# Altium schematic sheet Procesor.SchDoc
size A3
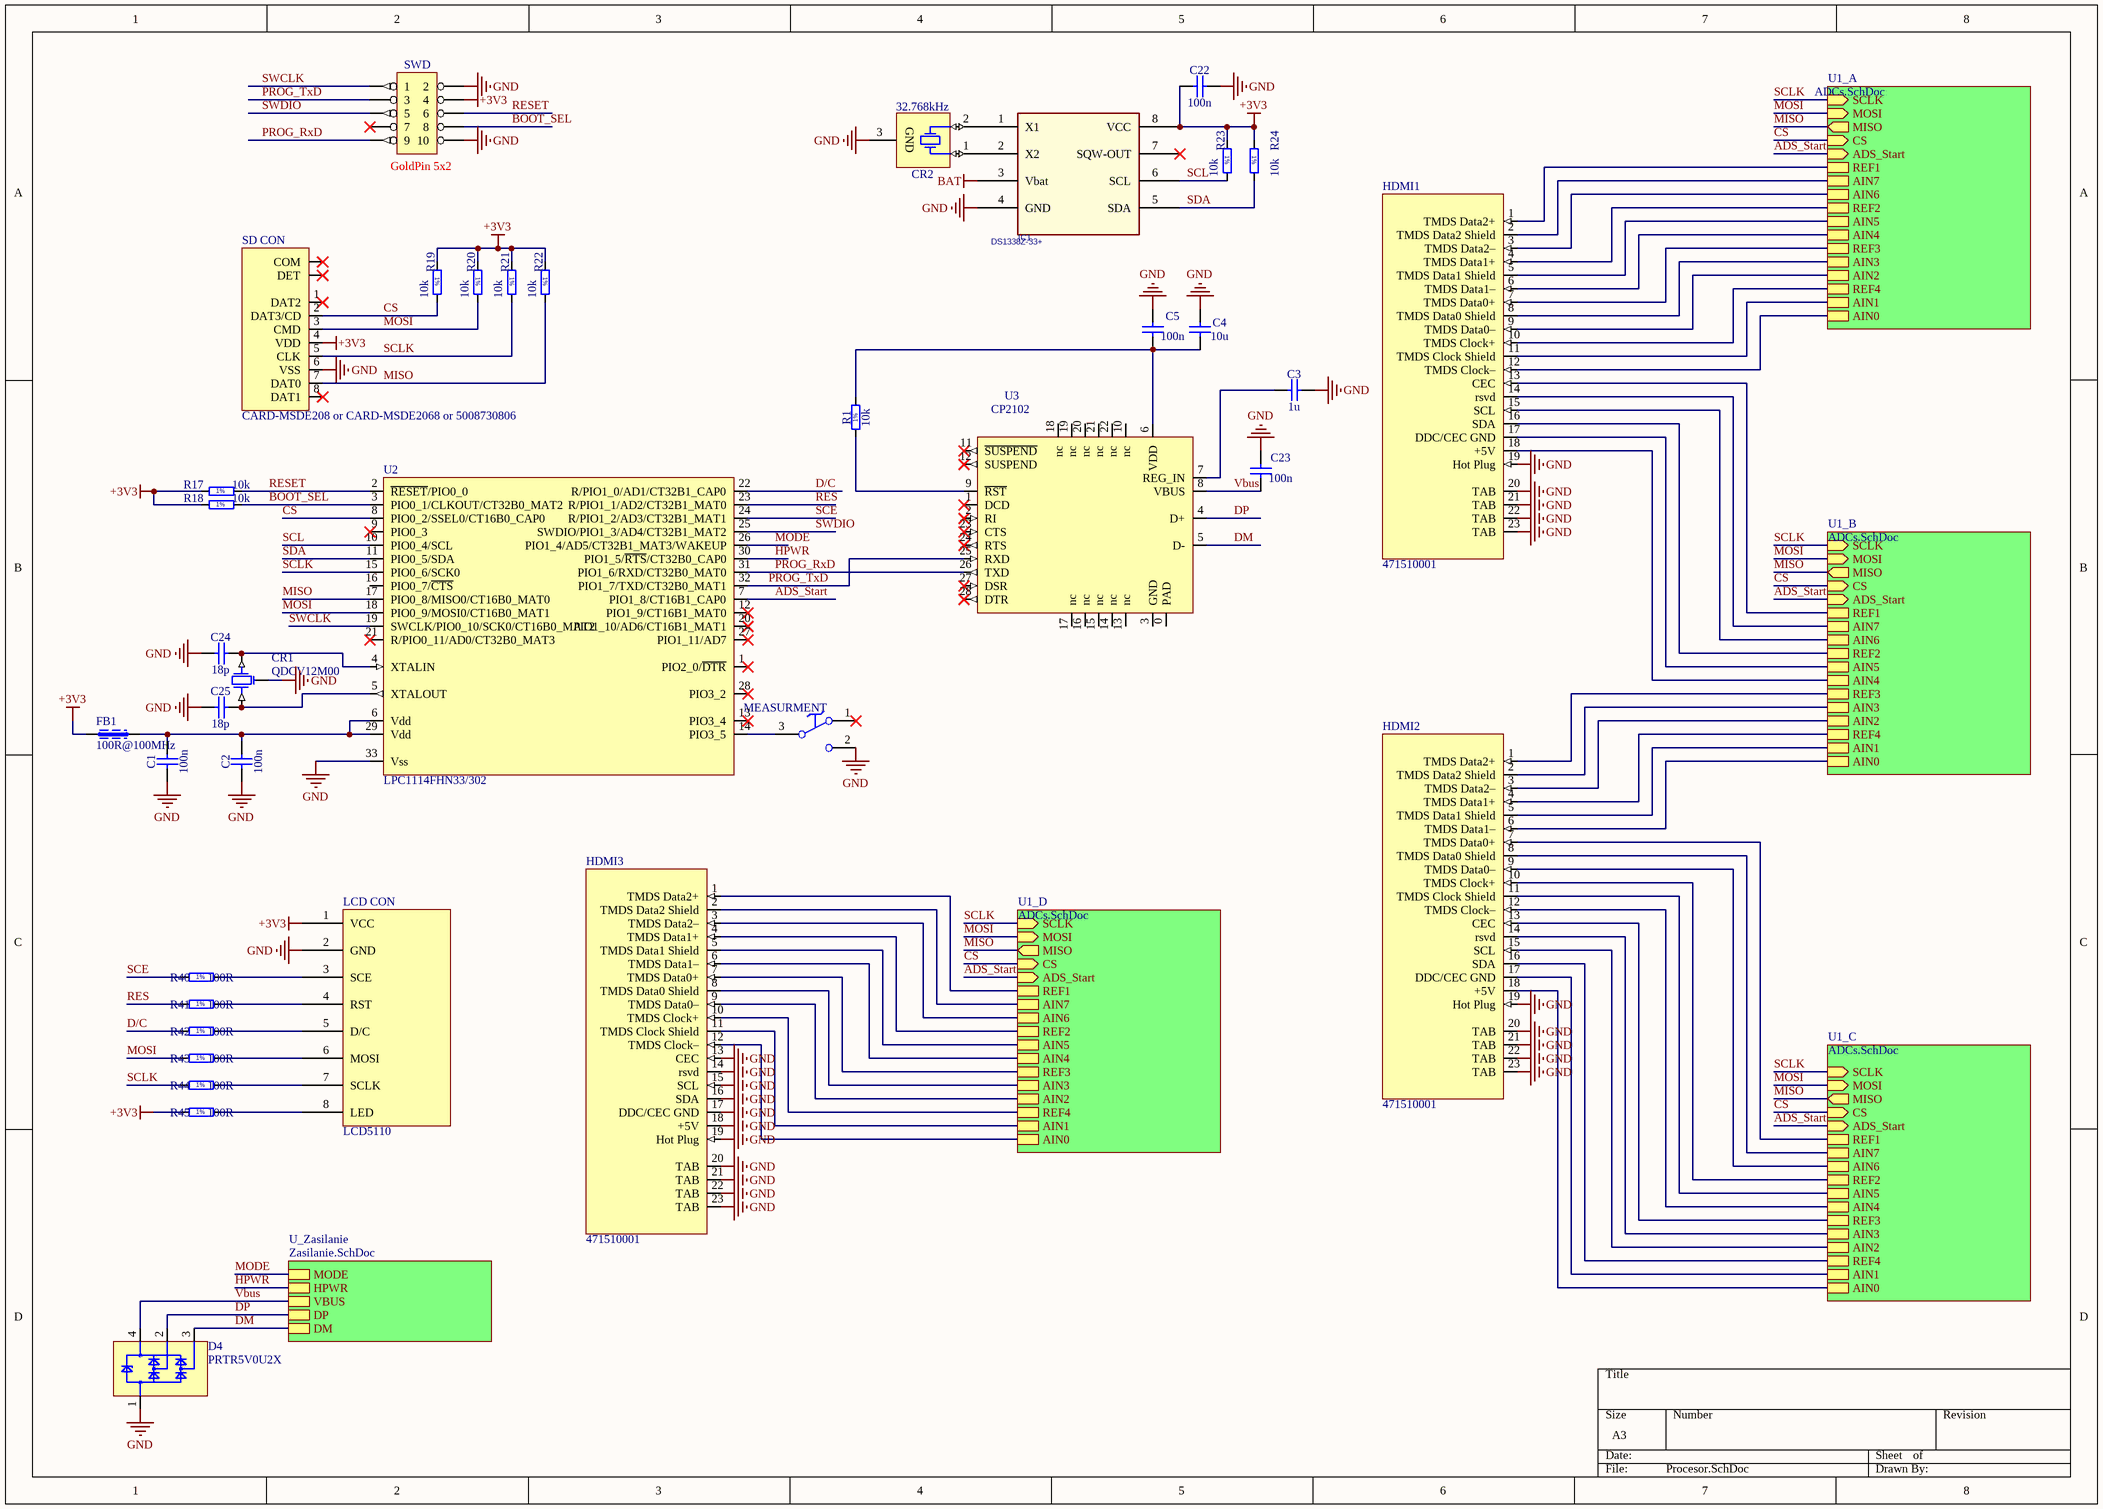
[diagram p0: Procesor.SchDoc]

## Parts
C1  100n  [CAPC1005X55N]
C2  100n  [CAPC1005X55N]
C3  1u  [CAPC1608X87N]
C4  10u  [CAPC2012X135N]
C5  100n  [CAPC1005X55N]
C22  100n  [CAPC1005X55N]
C23  100n  [CAPC1005X55N]
C24  18p  [CAPC1608X87N]
C25  18p  [CAPC1608X87N]
CR1  QDCV12M00  [CERAMIC_RES_QDCV]
CR2  32.768kHz  [XTAL_MICRO-CRYSTAL_MS3V-T1R]
D4  PRTR5V0U2X  [sot143b]
FB1  100R@100MHz  [0603L]
HDMI1  471510001  [HDMI_471510001]
HDMI2  471510001  [HDMI_471510001]
HDMI3  471510001  [HDMI_471510001]
IC1  DS1338Z-33+  [SO-8]
LCD_CON  LCD5110  [Goldpin1x8SMD]
MEASURMENT  Switch  [SW_MENTOR_1850]  (value not drawn)
R1  10k  [RESC1005X40N]
R17  10k  [RESC1608X55N]
R18  10k  [RESC1608X55N]
R19  10k  [RESC1005X40N]
R20  10k  [RESC1005X40N]
R21  10k  [RESC1005X40N]
R22  10k  [RESC1005X40N]
R23  10k  [RESC1005X40N]
R24  10k  [RESC1005X40N]
R40  100R  [RESC1005X40N]
R41  100R  [RESC1005X40N]
R42  100R  [RESC1005X40N]
R43  100R  [RESC1005X40N]
R44  100R  [RESC1005X40N]
R45  100R  [RESC1005X40N]
SD_CON  CARD-MSDE208 or CARD-MSDE2068 or 5008730806  [MSDE208]
SWD  GoldPin 5x2  [CON_2x5_MINI]
U2  LPC1114FHN33/302  [HVQFN33_QFN127P600-8N]
U3  CP2102  [QFN28]

## Sub-sheets
U1_A = ADCs.SchDoc: SCLK (in), MOSI (in), MISO (out), CS (in), ADS_Start (in), REF1, AIN7, AIN6, REF2, AIN5, AIN4, REF3, AIN3, REF4, AIN2, AIN1, AIN0
U1_B = ADCs.SchDoc: SCLK (in), MOSI (in), MISO (out), CS (in), ADS_Start (in), REF1, AIN7, AIN6, REF2, AIN5, AIN4, REF3, AIN3, REF4, AIN2, AIN1, AIN0
U1_C = ADCs.SchDoc: SCLK (in), MOSI (in), MISO (out), CS (in), ADS_Start (in), REF1, AIN7, AIN6, REF2, AIN5, AIN4, REF3, AIN3, REF4, AIN2, AIN1, AIN0
U1_D = ADCs.SchDoc: SCLK (in), MOSI (in), MISO (out), CS (in), ADS_Start (in), REF1, AIN7, AIN6, REF2, AIN5, AIN4, REF3, AIN3, REF4, AIN2, AIN1, AIN0
U_Zasilanie = Zasilanie.SchDoc: DM, DP, VBUS, HPWR, MODE

## Nets
+3V3: C22.1 FB1.1 IC1.8(VCC) LCD_CON.1(VCC) R17.1 R18.1 R19.1 R20.1 R21.1 R22.1 R23.1 R24.1 R45.1 SD_CON.4(VDD) SWD.4
BAT: IC1.3(Vbat)
GND: C1.1 C2.1 C3.2 C4.1 C5.2 C22.2 C23.2 C24.1 C25.1 CR1.2 CR2.3(GND) D4.1 HDMI1.19(Hot_Plug) HDMI1.20(TAB) HDMI1.21(TAB) HDMI1.22(TAB) HDMI1.23(TAB) HDMI2.19(Hot_Plug) HDMI2.20(TAB) HDMI2.21(TAB) HDMI2.22(TAB) HDMI2.23(TAB) HDMI3.13(CEC) HDMI3.14(rsvd) HDMI3.15(SCL) HDMI3.16(SDA) HDMI3.17(DDC/CEC_GND) HDMI3.18(+5V) HDMI3.19(Hot_Plug) HDMI3.20(TAB) HDMI3.21(TAB) HDMI3.22(TAB) HDMI3.23(TAB) IC1.4(GND) LCD_CON.2(GND) MEASURMENT.2 SD_CON.6(VSS) SWD.2 SWD.10 U2.33(Vss)
ADS_Start: U2.7(PIO1_8/CT16B1_CAP0) ; sheet U1_A/ADS_Start, sheet U1_B/ADS_Start, sheet U1_C/ADS_Start, sheet U1_D/ADS_Start
BOOT_SEL: R18.2 SWD.8 U2.3(PIO0_1/CLKOUT/CT32B0_MAT2)
CS: R19.2 SD_CON.2(DAT3/CD) U2.8(PIO0_2/SSEL0/CT16B0_CAP0) ; sheet U1_A/CS, sheet U1_B/CS, sheet U1_C/CS, sheet U1_D/CS
D/C: R42.1 U2.22(R/PIO1_0/AD1/CT32B1_CAP0)
DM: D4.3 U3.5(D-) ; sheet U_Zasilanie/DM
DP: D4.2 U3.4(D+) ; sheet U_Zasilanie/DP
HPWR: U2.30(PIO1_5/~{RTS}/CT32B0_CAP0) ; sheet U_Zasilanie/HPWR
MISO: R22.2 SD_CON.7(DAT0) U2.17(PIO0_8/MISO0/CT16B0_MAT0) ; sheet U1_A/MISO, sheet U1_B/MISO, sheet U1_C/MISO, sheet U1_D/MISO
MODE: U2.26(PIO1_4/AD5/CT32B1_MAT3/WAKEUP) ; sheet U_Zasilanie/MODE
MOSI: R20.2 R43.1 SD_CON.3(CMD) U2.18(PIO0_9/MOSI0/CT16B0_MAT1) ; sheet U1_A/MOSI, sheet U1_B/MOSI, sheet U1_C/MOSI, sheet U1_D/MOSI
PROG_RxD: SWD.9 U2.31(PIO1_6/RXD/CT32B0_MAT0) U3.26(TXD)
PROG_TxD: SWD.3 U2.32(PIO1_7/TXD/CT32B0_MAT1) U3.25(RXD)
RES: R41.1 U2.23(R/PIO1_1/AD2/CT32B1_MAT0)
RESET: R17.2 SWD.6 U2.2(~{RESET}/PIO0_0)
SCE: R40.1 U2.24(R/PIO1_2/AD3/CT32B1_MAT1)
SCL: IC1.6(SCL) R23.2 U2.10(PIO0_4/SCL)
SCLK: R21.2 R44.1 SD_CON.5(CLK) U2.15(PIO0_6/SCK0) ; sheet U1_A/SCLK, sheet U1_B/SCLK, sheet U1_C/SCLK, sheet U1_D/SCLK
SDA: IC1.5(SDA) R24.2 U2.11(PIO0_5/SDA)
SWCLK: SWD.1 U2.19(SWCLK/PIO0_10/SCK0/CT16B0_MAT2)
SWDIO: SWD.5 U2.25(SWDIO/PIO1_3/AD4/CT32B1_MAT2)
Vbus: C23.1 D4.4 U3.8(VBUS) ; sheet U_Zasilanie/VBUS
NetC1_2: C1.2 C2.2 FB1.2 U2.6(Vdd) U2.29(Vdd)
NetC3_1: C3.1 U3.7(REG_IN)
NetC4_2: C4.2 C5.1 R1.2 U3.6(VDD)
NetC24_2: C24.2 CR1.1 U2.4(XTALIN)
NetC25_2: C25.2 CR1.3 U2.5(XTALOUT)
NetCR2_1: CR2.1(X) IC1.2(X2)
NetCR2_2: CR2.2(X) IC1.1(X1)
NetHDMI1_1: HDMI1.1(TMDS_Data2+) ; sheet U1_A/REF1
NetHDMI1_2: HDMI1.2(TMDS_Data2_Shield) ; sheet U1_A/AIN7
NetHDMI1_3: HDMI1.3(TMDS_Data2–) ; sheet U1_A/AIN6
NetHDMI1_4: HDMI1.4(TMDS_Data1+) ; sheet U1_A/REF2
NetHDMI1_5: HDMI1.5(TMDS_Data1_Shield) ; sheet U1_A/AIN5
NetHDMI1_6: HDMI1.6(TMDS_Data1–) ; sheet U1_A/AIN4
NetHDMI1_7: HDMI1.7(TMDS_Data0+) ; sheet U1_A/REF3
NetHDMI1_8: HDMI1.8(TMDS_Data0_Shield) ; sheet U1_A/AIN3
NetHDMI1_9: HDMI1.9(TMDS_Data0–) ; sheet U1_A/AIN2
NetHDMI1_10: HDMI1.10(TMDS_Clock+) ; sheet U1_A/REF4
NetHDMI1_11: HDMI1.11(TMDS_Clock_Shield) ; sheet U1_A/AIN1
NetHDMI1_12: HDMI1.12(TMDS_Clock–) ; sheet U1_A/AIN0
NetHDMI1_13: HDMI1.13(CEC) ; sheet U1_B/REF1
NetHDMI1_14: HDMI1.14(rsvd) ; sheet U1_B/AIN7
NetHDMI1_15: HDMI1.15(SCL) ; sheet U1_B/AIN6
NetHDMI1_16: HDMI1.16(SDA) ; sheet U1_B/REF2
NetHDMI1_17: HDMI1.17(DDC/CEC_GND) ; sheet U1_B/AIN5
NetHDMI1_18: HDMI1.18(+5V) ; sheet U1_B/AIN4
NetHDMI2_1: HDMI2.1(TMDS_Data2+) ; sheet U1_B/REF3
NetHDMI2_2: HDMI2.2(TMDS_Data2_Shield) ; sheet U1_B/AIN3
NetHDMI2_3: HDMI2.3(TMDS_Data2–) ; sheet U1_B/AIN2
NetHDMI2_4: HDMI2.4(TMDS_Data1+) ; sheet U1_B/REF4
NetHDMI2_5: HDMI2.5(TMDS_Data1_Shield) ; sheet U1_B/AIN1
NetHDMI2_6: HDMI2.6(TMDS_Data1–) ; sheet U1_B/AIN0
NetHDMI2_7: HDMI2.7(TMDS_Data0+) ; sheet U1_C/REF1
NetHDMI2_8: HDMI2.8(TMDS_Data0_Shield) ; sheet U1_C/AIN7
NetHDMI2_9: HDMI2.9(TMDS_Data0–) ; sheet U1_C/AIN6
NetHDMI2_10: HDMI2.10(TMDS_Clock+) ; sheet U1_C/REF2
NetHDMI2_11: HDMI2.11(TMDS_Clock_Shield) ; sheet U1_C/AIN5
NetHDMI2_12: HDMI2.12(TMDS_Clock–) ; sheet U1_C/AIN4
NetHDMI2_13: HDMI2.13(CEC) ; sheet U1_C/REF3
NetHDMI2_14: HDMI2.14(rsvd) ; sheet U1_C/AIN3
NetHDMI2_15: HDMI2.15(SCL) ; sheet U1_C/AIN2
NetHDMI2_16: HDMI2.16(SDA) ; sheet U1_C/REF4
NetHDMI2_17: HDMI2.17(DDC/CEC_GND) ; sheet U1_C/AIN1
NetHDMI2_18: HDMI2.18(+5V) ; sheet U1_C/AIN0
NetHDMI3_1: HDMI3.1(TMDS_Data2+) ; sheet U1_D/REF1
NetHDMI3_2: HDMI3.2(TMDS_Data2_Shield) ; sheet U1_D/AIN7
NetHDMI3_3: HDMI3.3(TMDS_Data2–) ; sheet U1_D/AIN6
NetHDMI3_4: HDMI3.4(TMDS_Data1+) ; sheet U1_D/REF2
NetHDMI3_5: HDMI3.5(TMDS_Data1_Shield) ; sheet U1_D/AIN5
NetHDMI3_6: HDMI3.6(TMDS_Data1–) ; sheet U1_D/AIN4
NetHDMI3_7: HDMI3.7(TMDS_Data0+) ; sheet U1_D/REF3
NetHDMI3_8: HDMI3.8(TMDS_Data0_Shield) ; sheet U1_D/AIN3
NetHDMI3_9: HDMI3.9(TMDS_Data0–) ; sheet U1_D/AIN2
NetHDMI3_10: HDMI3.10(TMDS_Clock+) ; sheet U1_D/REF4
NetHDMI3_11: HDMI3.11(TMDS_Clock_Shield) ; sheet U1_D/AIN1
NetHDMI3_12: HDMI3.12(TMDS_Clock–) ; sheet U1_D/AIN0
NetLCD_CON_3: LCD_CON.3(SCE) R40.2
NetLCD_CON_4: LCD_CON.4(RST) R41.2
NetLCD_CON_5: LCD_CON.5(D/C) R42.2
NetLCD_CON_6: LCD_CON.6(MOSI) R43.2
NetLCD_CON_7: LCD_CON.7(SCLK) R44.2
NetLCD_CON_8: LCD_CON.8(LED) R45.2
NetMEASURMENT_3: MEASURMENT.3 U2.14(PIO3_5)
NetR1_1: R1.1 U3.9(~{RST})

Not connected (* = marked no-connect by the designer): IC1 7(SQW-OUT)*; MEASURMENT 1*; SD_CON 1(DAT2)* 8(DAT1)* CD(DET)* COM*; SWD 7*; U2 1(PIO2_0/~{DTR})* 9(PIO0_3)* 12(PIO1_9/CT16B1_MAT0)* 13(PIO3_4)* 16(PIO0_7/~{CTS}) 20(PIO1_10/AD6/CT16B1_MAT1)* 21(R/PIO0_11/AD0/CT32B0_MAT3)* 27(PIO1_11/AD7)* 28(PIO3_2)*; U3 0(PAD) 1(DCD)* 2(RI)* 3(GND) 10(nc) 11(~{SUSPEND})* 12(SUSPEND)* 13(nc) 14(nc) 15(nc) 16(nc) 17(nc) 18(nc) 19(nc) 20(nc) 21(nc) 22(nc) 23(CTS)* 24(RTS)* 27(DSR)* 28(DTR)*

## Notes on the sheet
- (in symbol R0402_10K_1%_0.0625W_100PPM) 1%
- (in symbol R0402_10R_1%_0.0625W_200PPM) 1%
- (in symbol R0603_10K_1%_0.1W_100PPM) 1%

## Library data of the parts
C1 C2 C5 C22 C23 = CC0402_100NF_16V_10%_X7R: Non-polarised capacitor; Part Description: SMD Multilayer Chip Ceramic Capacitor; Manufacturer: GENERIC; Manufacturer1 Part Number: 223878715649; Value: 100nF; Voltage: 16V; TC: X7R; Tolerance: ±10%; Table: Capacitors SMD; Part Number: CC0402_100NF_16V_10%_X7R; Component Kind: Standard; Component Type: Standard; Pin Count: 2; Status: Not Recommended; Manufacturer Part Number: CC0402_100NF_16V_10%_X7R; Case: 0402; Mounted: Yes; Socket: No; SMD: Yes; Manufacturer1 Example: PHYCOMP; Manufacturer1 ComponentHeight: 0.55mm; HelpURL: \\cern.ch\dfs\Applications\Altium\Datasheets\CC0402_X7R_PHYCOMP.pdf; Author: CERN DEM JLC; CreateDate: 2007-12-03; LatestRevisionDate: 2007-12-03
C3 = CC0603_1UF_16V_10%_X7R: Non-polarised capacitor; Part Description: SMD Multilayer Chip Ceramic Capacitor; Manufacturer: GENERIC; Manufacturer1 Part Number: 223824613663; Value: 1uF; Voltage: 16V; TC: X7R; Tolerance: ±10%; Table: Capacitors SMD; Part Number: CC0603_1UF_16V_10%_X7R; Component Kind: Standard; Component Type: Standard; Pin Count: 2; Status: Preferred; Manufacturer Part Number: CC0603_1uF_16V_10%_X7R; Case: 0603; Mounted: Yes; Socket: No; SMD: Yes; Manufacturer1 Example: PHYCOMP; Manufacturer1 ComponentHeight: 0.87mm; HelpURL: \\cern.ch\dfs\Applications\Altium\Datasheets\CC0805_X5R_PHYCOMP_HC.pdf; Author: CERN DEM JLC; CreateDate: 2007-12-03; LatestRevisionDate: 2007-12-03
C4 = CC0805_10UF_16V_10%_X5R: Non-polarised capacitor; Part Description: SMD Multilayer Chip Ceramic Capacitor; Manufacturer: GENERIC; Manufacturer1 Part Number: C0805C106K4PAC; Value: 10uF; Voltage: 16V; TC: X5R; Tolerance: ±10%; Table: Capacitors SMD; Part Number: CC0805_10UF_16V_10%_X5R; Component Kind: Standard; Component Type: Standard; Pin Count: 2; Status: Preferred; Manufacturer Part Number: CC0805_10UF_16V_10%_X5R; Case: 0805; Mounted: Yes; Socket: No; SMD: Yes; Manufacturer1 Example: KEMET; Manufacturer1 ComponentHeight: 1.4mm; HelpURL: \\cern.ch\dfs\Applications\Altium\Datasheets\CC1206_X5R_KEMET.pdf; Author: CERN DEM JLC; CreateDate: 2007-12-03; LatestRevisionDate: 2007-12-03
C24 C25 = CC0603_18PF_50V_5%_NP0: Non-polarised capacitor; Part Description: SMD Multilayer Chip Ceramic Capacitor; Manufacturer: GENERIC; Manufacturer1 Part Number: 223886715189; Value: 18pF; Voltage: 50V; TC: NP0; Tolerance: ±5%; Table: Capacitors SMD; Part Number: CC0603_18PF_50V_5%_NP0; Component Kind: Standard; Component Type: Standard; Pin Count: 2; Status: Preferred; Manufacturer Part Number: CC0603_18PF_50V_5%_NP0; Case: 0603; Mounted: Yes; Socket: No; SMD: Yes; Manufacturer1 Example: PHYCOMP; Manufacturer1 ComponentHeight: 0.87mm; HelpURL: \\cern.ch\dfs\Applications\Altium\Datasheets\CC0603_NP0_PHYCOMP.pdf; Author: CERN DEM JLC; CreateDate: 2007-12-03; LatestRevisionDate: 2007-12-03
CR1 = X_CERAMIC_RES: ceramic resonator QCC(QDCV)12.00 (Maritex)
CR2 = XTAL_32.768 KHZ_MICRO-CRYSTAL_MS3V-T1R 32.768 KHZ 12.5PF 20PPM: Crystal 3 pins 1=XTAL 2=XTAL 3=GND; Part Description: Tolerance:± 20ppm, -40°C to +85°C, 12.5pF,  Surface Mount Crystal, MS3V-T1R Serie; Manufacturer: MICRO CRYSTAL; Manufacturer Part Number: MS3V-T1R 32.768 KHZ 12.5PF 20PPM TAQC; Table: Crystals & Oscillators; Part Number: XTAL_32.768 KHZ_MICRO-CRYSTAL_MS3V-T1R 32.768 KHZ 12.5PF 20PPM; Component Kind: Standard; Component Type: Standard; PackageDescription: 2 Pins, 1.4 x 5.2 x 1.4mm , SMD Crystal, MS3V-T1R Serie; Value: 32.768kHz; Pin Count: 3; Mounted: Yes; Socket: No; SMD: Yes; ComponentHeight: 1.48mm; HelpURL: \\cern.ch\dfs\Applications\Altium\Datasheets\XTAL_MICRO-CRYSTAL_MS3V-T1R.pdf; Author: CERN DEM JLC; CreateDate: 2013-02-21; LatestRevisionDate: 2013-02-21
D4 = D_TVS_PRTR5V0U2X: dual 5.5 ESD transient voltage suppressor
FB1 = L_FERRITE_BEAD: ferrite bead
HDMI1-HDMI3 = CON_HDMI_OUT: HDMI connector with flante (Multicomp, Farnell); Supplier 1: Farnell; Supplier Part Number 1: 1428260
IC1 = RTC_DS1338U-33: RTC; Part Number: 1.1.05.12.006; Manufacture: Maxim; Name: INS16799019; Spec: DS1338U-33; Type: IC-else; Supplier 1: Newark; Supplier Part Number 1: 27K7425
MEASURMENT = SW_MENTOR_1850.1031: SPDT Switch; Part Description: SPDT Toggle Switch - PCB Edge Mounting; Manufacturer: MENTOR; SCEM: 07.88.10.140.4; Table: Switches; Part Number: SW_MENTOR_1850.1031; Component Kind: Standard; Component Type: Standard; Pin Count: 3; PackageDescription: SPDT Switch - PCB Edge Mounting - MENTOR_1850; Family: Switch; Mounted: Yes; Socket: No; SMD: No; Status: None; Manufacturer Part Number: 1850.1031; ComponentHeight: 9.95mm; HelpURL: \\cern.ch\dfs\Applications\Altium\Datasheets\SW_MENTOR_1850.1031.pdf; Author: CERN DEM JMW; CreateDate: 2008-10-03; LatestRevisionDate: 2008-10-03
R1 R19-R24 = R0402_10K_1%_0.0625W_100PPM: Resistor - 1%; Part Description: General Purpose Thick Film Chip Resistor; Manufacturer: GENERIC; Manufacturer1 Part Number: 232270671003; TC: ±100ppm/°C; Table: Resistors SMD; Component Kind: Standard; Component Type: Standard; Pin Count: 2; Value: 10k; Status: Not recommended; Power: 0.0625W; Tolerance: ±1%; Manufacturer Part Number: R0402_10K_1%_0.0625W_100PPM; Case: 0402; Mounted: Yes; Socket: No; SMD: Yes; Manufacturer1 Example: PHYCOMP; Manufacturer1 ComponentHeight: 0.4mm; HelpURL: \\cern.ch\dfs\Applications\Altium\Datasheets\R0402_Phycomp_RC0402.pdf; Author: CERN DEM JLC; CreateDate: 2007-12-03; LatestRevisionDate: 2008-03-13
  R1 R19 R20 R22-R24: Part Number: R0402_10K_1%_0.0625W_100PPM
R17 R18 = R0603_10K_1%_0.1W_100PPM: Resistor - 1%; Part Description: General Purpose Thick Film Chip Resistor; Manufacturer: GENERIC; Manufacturer1 Part Number: NRC06F1002TRF; Power: 0.1W; TC: ±100ppm/°C; Table: Resistors SMD; Part Number: R0603_10K_1%_0.1W_100PPM; Component Kind: Standard; Component Type: Standard; Pin Count: 2; Value: 10k; Status: Preferred; Tolerance: ±1%; Manufacturer Part Number: R0603_10K_1%_0.1W_100PPM; Case: 0603; Mounted: Yes; Socket: No; SMD: Yes; Manufacturer1 Example: NIC COMPONENT; Manufacturer1 ComponentHeight: 0.55mm; HelpURL: \\cern.ch\dfs\Applications\Altium\Datasheets\R0603_NIC_NRC.pdf; Author: CERN DEM JLC; CreateDate: 2007-12-03; LatestRevisionDate: 2008-03-13
R40-R45 = R0402_10R_1%_0.0625W_200PPM: Resistor - 1%; Part Description: General Purpose Thick Film Chip Resistor; Manufacturer: GENERIC; Manufacturer1 Part Number: 232270671009L; Value: 10; TC: ±200ppm/°C; Table: Resistors SMD; Part Number: R0402_10R_1%_0.0625W_200PPM; Component Kind: Standard; Component Type: Standard; Pin Count: 2; Status: Not recommended; Power: 0.0625W; Tolerance: ±1%; Manufacturer Part Number: R0402_10R_1%_0.0625W_200PPM; Case: 0402; Mounted: Yes; Socket: No; SMD: Yes; Manufacturer1 Example: YAGEO PHYCOMP; Manufacturer1 ComponentHeight: 0.4mm; HelpURL: \\cern.ch\dfs\Applications\Altium\Datasheets\R0402_Phycomp_RC0402.pdf; Author: CERN DEM JLC; CreateDate: 2009-06-24; LatestRevisionDate: 2012-10-17
SD_CON = CON_CARD_microSD_push-push: Secure Digital Cards socket (Maritex); Supplier 1: Arrow; Supplier Part Number 1: 46118222S9776661N3303
SWD = HEADER 5X2
U2 = UPC_LPC1111